# Altium schematic sheet HEATER.SchDoc
size 420 x 297 mm; SheetNumber: 15; SheetTotal: 19
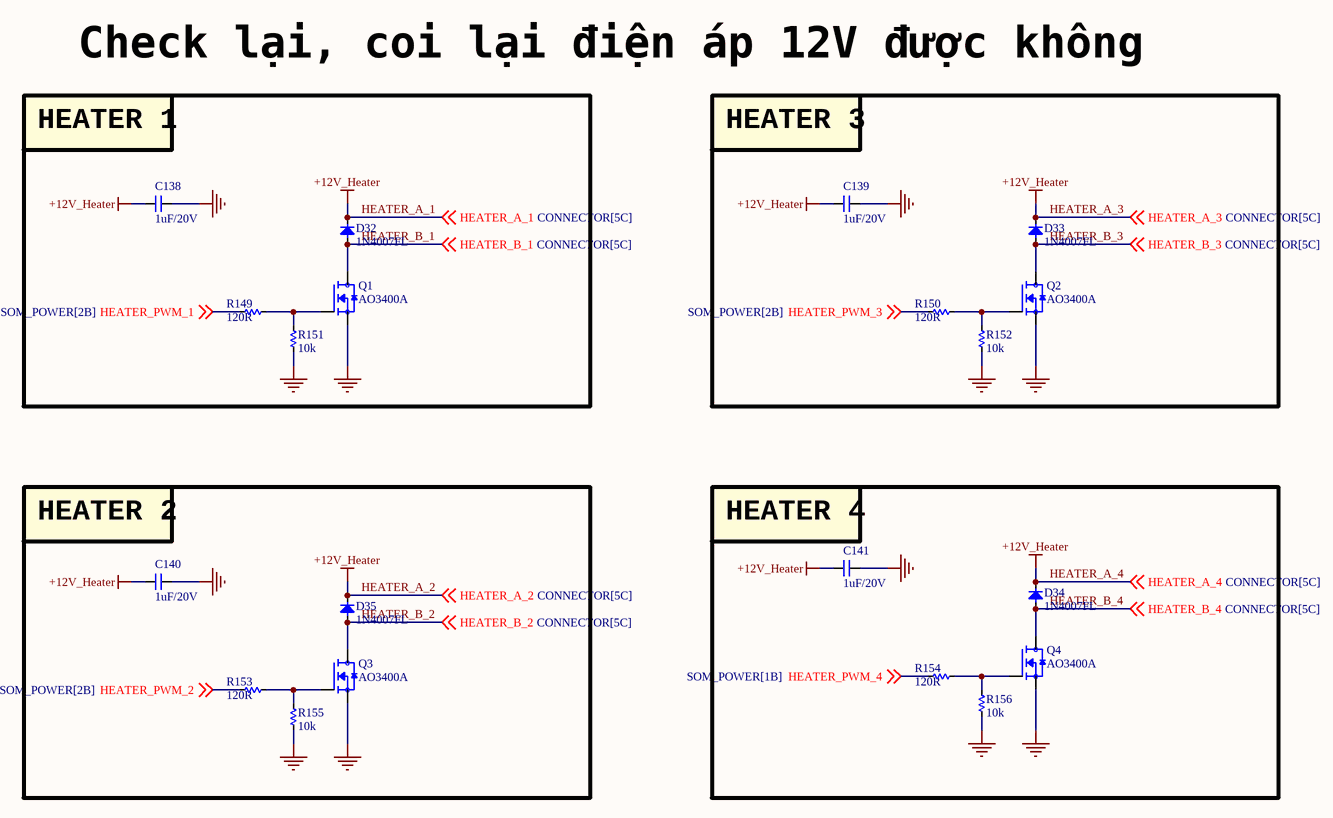
[diagram p0: HEATER.SchDoc]

## Parts
C138  1uF/20V  [CAP_C_1005X60]
C139  1uF/20V  [CAP_C_1005X60]
C140  1uF/20V  [CAP_C_1005X60]
C141  1uF/20V  [CAP_C_1005X60]
D32  1N4007FL  [DIO-SMD-106]
D33  1N4007FL  [DIO-SMD-106]
D34  1N4007FL  [DIO-SMD-106]
D35  1N4007FL  [DIO-SMD-106]
Q1  AO3400A  [SOT95P240X120-3N]
Q2  AO3400A  [SOT95P240X120-3N]
Q3  AO3400A  [SOT95P240X120-3N]
Q4  AO3400A  [SOT95P240X120-3N]
R149  120R  [RES_C_1005X40]
R150  120R  [RES_C_1005X40]
R151  10k  [RES_C_1005X40]
R152  10k  [RES_C_1005X40]
R153  120R  [RES_C_1005X40]
R154  120R  [RES_C_1005X40]
R155  10k  [RES_C_1005X40]
R156  10k  [RES_C_1005X40]

## Blocks framed on the sheet
HEATER 1: C138 D32 Q1 R149 R151
HEATER 3: C139 D33 Q2 R150 R152
HEATER 2: C140 D35 Q3 R153 R155
HEATER 4: C141 D34 Q4 R154 R156

## Nets
GND: C138.1 C139.1 C140.1 C141.1 Q1.2(S) Q2.2(S) Q3.2(S) Q4.2(S) R151.1 R152.1 R155.1 R156.1
HEATER_A_1: C138.2 C139.2 C140.2 C141.2 D32.1(K) D33.1(K) D34.1(K) D35.1(K) ; off-sheet HEATER_A_1, off-sheet HEATER_A_2, off-sheet HEATER_A_3, off-sheet HEATER_A_4  [also labelled +12V_Heater, HEATER_A_2, HEATER_A_3, HEATER_A_4]
HEATER_B_1: D32.2(A) Q1.3(D) ; off-sheet HEATER_B_1
HEATER_B_2: D35.2(A) Q3.3(D) ; off-sheet HEATER_B_2
HEATER_B_3: D33.2(A) Q2.3(D) ; off-sheet HEATER_B_3
HEATER_B_4: D34.2(A) Q4.3(D) ; off-sheet HEATER_B_4
HEATER_PWM_1: R149.1 ; off-sheet HEATER_PWM_1
HEATER_PWM_2: R153.1 ; off-sheet HEATER_PWM_2
HEATER_PWM_3: R150.1 ; off-sheet HEATER_PWM_3
HEATER_PWM_4: R154.1 ; off-sheet HEATER_PWM_4
NetQ1_1: Q1.1(G) R149.2 R151.2
NetQ2_1: Q2.1(G) R150.2 R152.2
NetQ3_1: Q3.1(G) R153.2 R155.2
NetQ4_1: Q4.1(G) R154.2 R156.2

## Notes on the sheet
- Check lại, coi lại điện áp 12V được không
- Project:
- Sub-system:
- Design by:
- Sheet title:
- Sheet
- of
- Checked by:
- Approved by:
- Revision:
- Document No:
- Size:
- Date:
- A3

## Library data of the parts
C138-C141 = _CAP_C_2: CAP CHIP
D32-D35 = Diode SMD: Default Diode; Code - JEDEC: DO-214-AB; Value: 1N5007; Published: 8-Jun-2000; Revision: July-2002: Re-released for DXP Platform.; Publisher: Altium Limited
Q1-Q4 = MOSFET_N: N-Channel 30 V 5.7A (Ta) 1.4W (Ta) Surface Mount SOT-23-3; MF: Alpha & Omega Semiconductor; SnapEDA_Link: https://www.snapeda.com/parts/AO3400A/Alpha/view-part/?ref=snap; Package: SOT-23 Alpha &amp; Omega Semiconductor Inc.; Value: *; MP: AO3400A; Check_prices: https://www.snapeda.com/parts/AO3400A/Alpha/view-part/?ref=eda
R149-R156 = _RES_B_2: RES